# EAGLE design breadboard power supply smd (EAGLE 6.1)
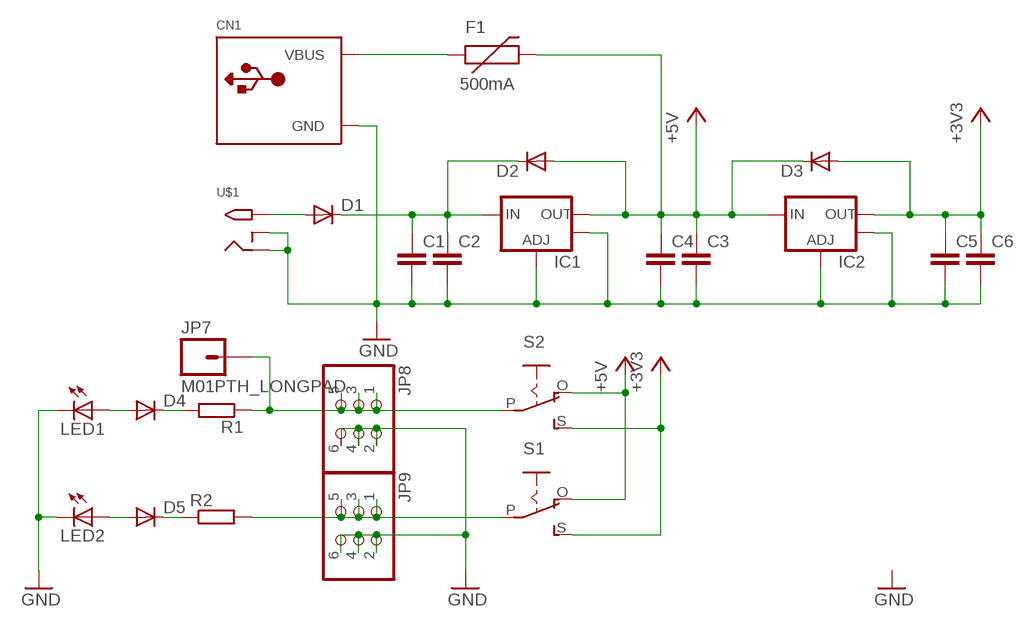
[diagram p0: schematic, sheet 1]

## Parts
C1  C-EUC0805K  [C0805K]
C2  C-EUC0805K  [C0805K]
C3  C-EUC0805K  [C0805K]
C4  C-EUC0805K  [C0805K]
C5  C-EUC0805K  [C0805K]
C6  C-EUC0805K  [C0805K]
CN1  USBPWR-ONLY  [USB-MINIB-THM]
D1  DIODE-MINIMELF  [MINIMELF]
D2  DIODE-MINIMELF  [MINIMELF]
D3  DIODE-MINIMELF  [MINIMELF]
D4  DIODE-MINIMELF  [MINIMELF]
D5  DIODE-MINIMELF  [MINIMELF]
F1  500mA  PTC0603  [0603]
IC1  V_REG_LM1117SOT223  [SOT223]
IC2  V_REG_LM1117SOT223  [SOT223]
JP7  M01PTH_LONGPAD  [1X01_LONGPAD]
JP8  PINHD-2X3  [2X03]
JP9  PINHD-2X3  [2X03]
LED1  LEDCHIP-LED0805  [CHIP-LED0805]
LED2  LEDCHIP-LED0805  [CHIP-LED0805]
R1  R-EU_R0805  [R0805]
R2  R-EU_R0805  [R0805]
S1  EG1218S  [EG1218]
S2  EG1218S  [EG1218]
U$1  2.1MMJACKTHM  [PJ-102A]

## Nets
+3V3: C5.1 C6.1 D3.A IC2.2(OUT) S1.S S2.S
+5V: C3.1 C4.1 D2.A D3.C F1.2 IC1.2(OUT) IC2.3(IN) S1.O S2.O
GND: C1.2 C2.2 C3.2 C4.2 C5.2 C6.2 CN1.GND CN1.GND1(GND) CN1.GND2(GND) CN1.GND3(GND) CN1.GND4(GND) IC1.1(ADJ) IC1.4(OUT) IC2.1(ADJ) IC2.4(OUT) JP8.2 JP8.4 JP8.6 JP9.2 JP9.4 JP9.6 LED1.C LED2.C U$1.RING U$1.RING_SW
N$1: D1.A U$1.TIP
N$2: D5.C R2.1
N$3: C1.1 C2.1 D1.C D2.C IC1.3(IN)
N$4: JP7.1 JP8.1 JP8.3 JP8.5 R1.1 S2.P
N$5: D4.C R1.2
N$6: JP9.1 JP9.3 JP9.5 R2.2 S1.P
N$7: D4.A LED1.A
N$8: D5.A LED2.A
N$9: CN1.VBUS F1.1

## Library data of the parts
C1-C6 = rcl:C-EU: CAPACITOR, European symbol
CN1 = _MY_OWN_LIB:USB: USB Connectors USBMINIB - Surface Mount Female Mini-B USB Connector 4UConnector: 06564 By microbuilder.eu Thru-hole RA Female Mini-B USB Connector 4UConnector: 18732 By ladyada.net
D1-D5 = diode:DIODE-: DIODE
F1 = SparkFun-PowerIC:PTC: Resettable Fuse PTC Resettable Fuse. Spark Fun Electronics SKU : COM-08357
IC1 IC2 = SparkFun-PowerIC:V_REG_LM1117: Voltage Regulator LM1117 Standard adjustable voltage regulator but in SMD form. Spark Fun Electronics SKU : COM-00595
JP7 = _MY_OWN_LIB:M01: Header 1 Standard 1-pin 0.1" header. Use with straight break away headers (SKU : PRT-00116), right angle break away headers (PRT-00553), swiss pins (PRT-00743), machine pins (PRT-00117), and female headers (PRT-00115).
JP8 JP9 = pinhead:PINHD-2X3: PIN HEADER
LED1 LED2 = led:LED: LED OSRAM: - CHIPLED LG R971, LG N971, LY N971, LG Q971, LY Q971, LO R971, LY R971 LH N974, LH R974 LS Q976, LO Q976, LY Q976 LO Q996 - Hyper CHIPLED LW Q18S LB Q993, LB Q99A, LB R99A - SideLED LS A670, LO A670, LY A670, LG A670, LP A670 LB A673, LV A673, LT A673, LW A673 LH A674 LY A675 LS A676, LA A676, LO A676, LY A676, LW A676 LS A679, LY A679, LG A679 - Hyper Micro SIDELED® LS Y876, LA Y876, LO Y876, LY Y876 LT Y87S - SmartLED LW L88C, LW L88S LB L89C, LB L89S, LG L890 LS L89K, LO L89K, LY L89K LS L896, LA L896, LO L896, LY L896 - TOPLED LS T670, LO T670, LY T670, LG T670, LP T670 LSG T670, LSP T670, LSY T670, LOP T670, LYG T670 LG T671, LOG T671, LSG T671 LB T673, LV T673, LT T673, LW T673 LH T674 LS T676, LA T676, LO T676, LY T676, LB T676, LH T676, LSB T676, LW T676 LB T67C, LV T67C, LT T67C, LS T67K, LO T67K, LY T67K, LW E67C LS E67B, LA E67B, LO E67B, LY E67B, LB E67C, LV E67C, LT E67C LW T67C LS T679, LY T679, LG T679 LS T770, LO T770, LY T770, LG T770, LP T770 LB T773, LV T773, LT T773, LW T773 LH T774 LS E675, LA E675, LY E675, LS T675 LS T776, LA T776, LO T776, LY T776, LB T776 LHGB T686 LT T68C, LB T68C - Hyper Mini TOPLED® LB M676 - Mini TOPLED Santana® LG M470 LS M47K, LO M47K, LY M47K Source: http://www.osram.convergy.de LUXEON: - LUMILED® LXK2-PW12-R00, LXK2-PW12-S00, LXK2-PW14-U00, LXK2-PW14-V00 LXK2-PM12-R00, LXK2-PM12-S00, LXK2-PM14-U00 LXK2-PE12-Q00, LXK2-PE12-R00, LXK2-PE12-S00, LXK2-PE14-T00, LXK2-PE14-U00 LXK2-PB12-K00, LXK2-PB12-L00, LXK2-PB12-M00, LXK2-PB14-N00, LXK2-PB14-P00, LXK2-PB14-Q00 LXK2-PR12-L00, LXK2-PR12-M00, LXK2-PR14-Q00, LXK2-PR14-R00 LXK2-PD12-Q00, LXK2-PD12-R00, LXK2-PD12-S00 LXK2-PH12-R00, LXK2-PH12-S00 LXK2-PL12-P00, LXK2-PL12-Q00, LXK2-PL12-R00 Source: www.luxeon.com KINGBRIGHT: KA-3528ASYC Source: www.kingbright.com
R1 R2 = rcl:R-EU_: RESISTOR, European symbol
S1 S2 = _MY_OWN_LIB:EG1218: SLIDING SWITCH 0.1" spacing through hole, vertical SPDT slide switch http://www.ladyada.net/library/pcb/eaglelibrary.html
U$1 = adafruit:2.1MMJACK: 2.1mm x 5.5mm THM DC jack with internal switch. Digikey part #PJ-102A, 4UCON part #05537 2.1mm x 5.5mm SMT DC jack with internal switch. Digikey part #PJ-002A-SMT, 4UCON part #03267 By microbuilder.eu & adafruit.com

## Board
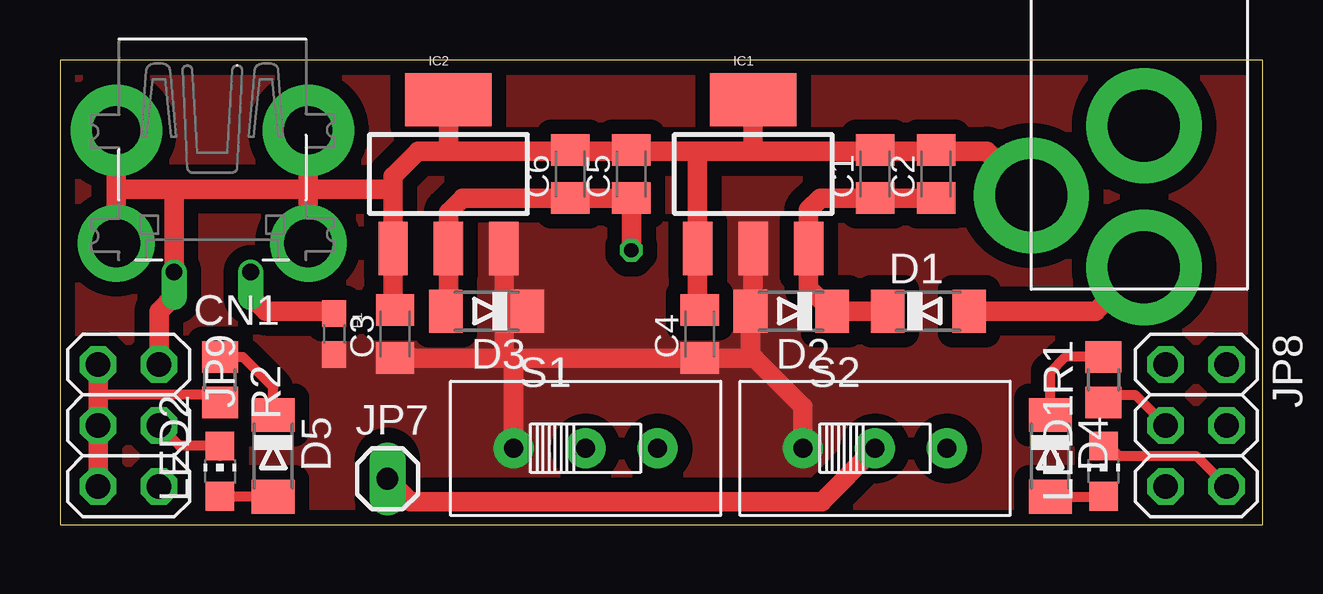
[diagram p1: board, top side]
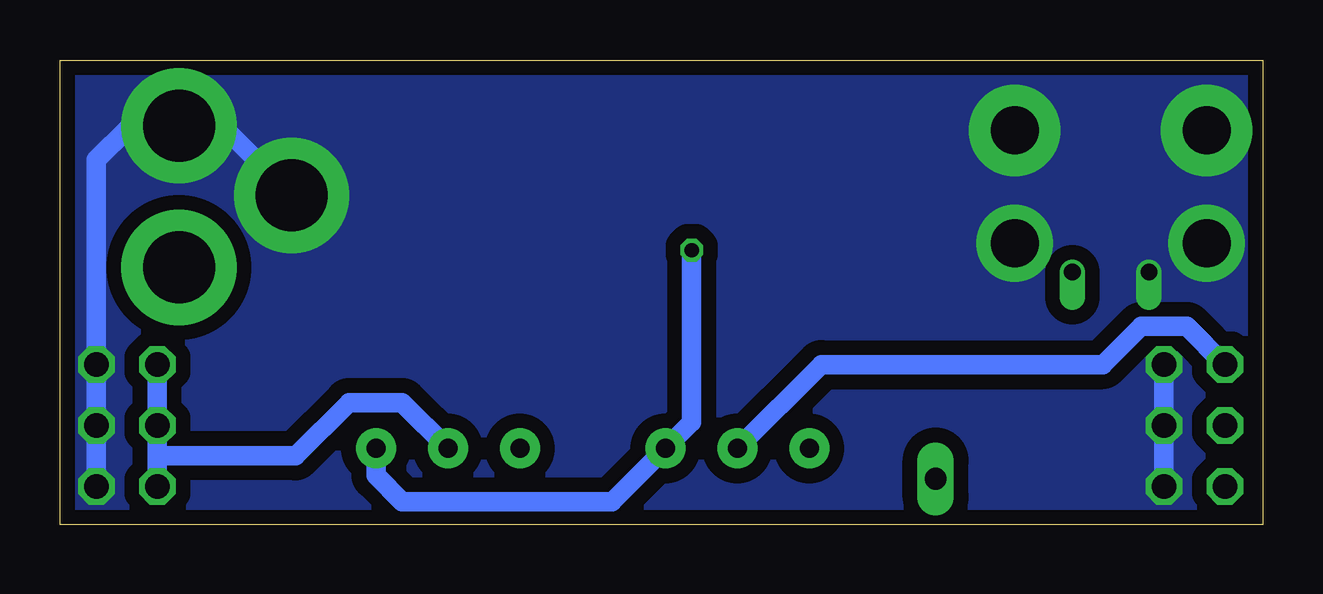
[diagram p2: board, bottom side, seen from below]

Size 50.15 x 19.36 mm. Coordinates in mm from the lower left corner, seen from the top.
Outline: 0,0 50.15,0 50.15,19.36 0,19.36 0,0
Copper layers (1*16): Top 0.0356mm / dielectric 1.5011mm / Bottom 0.0356mm
Design rules: minimum track width 6mil, minimum drill 13mil, track to track 6mil, track to pad 6mil, pad to pad 6mil, via to via 6mil, smd to smd 6mil, copper to edge 15mil, drill to drill 6mil, minimum pad ring 7mil, minimum via ring 7mil, stop-mask expansion 3mil, vias tented up to drill 0mil, thermal gap 10mil

### Footprints (pad centres in the part's own frame; a part is rotated, then mirrored left to right if it is on the bottom)
C0805K = smd 1.3 x 1.6: 1 -1,0; 2 1,0
USB-MINIB-THM = drill 0.7 offset: GND 1.6,9.8; VBUS -1.6,9.8 | drill 2 pad 3.81: GND1 -4,3.9; GND4 4,3.9 | drill 2 pad 3.2: GND2 -4,8.6; GND3 4,8.6
MINIMELF = smd 1.4 x 1.8: A 1.7,0; C -1.7,0
0603 = smd 1.1 x 1: 1 -0.85,0; 2 0.85,0
SOT223 = smd 1.219 x 2.235: 1 -2.311,-3.099; 2 0,-3.099; 3 2.311,-3.099 | smd 3.6 x 2.2: 4 0,3.099
1X01_LONGPAD = drill 0.9 pad 1.524 long: 1 0,0
2X03 = drill 1.016 octagon: 1 -2.54,-1.27; 2 -2.54,1.27; 3 0,-1.27; 4 0,1.27; 5 2.54,-1.27; 6 2.54,1.27
CHIP-LED0805 = smd 1.2 x 1.2: A 0,-1.05; C 0,1.05
R0805 = smd 1.3 x 1.5: 1 -0.95,0; 2 0.95,0
EG1218 = drill 0.8 pad 1.676: O -3,0; P 0,0; S 3,0
PJ-102A = drill 3 pad 4.8: RING 0.1,-3.39; RING_SW -4.6,-6.29; TIP 0.1,-9.29

### Placement (x,y rotation side)
C1  33.97,14.61 90 top
C2  36.51,14.61 90 top
C3  13.97,7.94 90 top
C4  26.67,7.94 90 top
C5  23.81,14.61 90 top
C6  21.27,14.61 90 top
CN1  6.35,20.32 180 top
D1  36.2,8.89 0 top
D2  30.48,8.89 180 top
D3  17.78,8.89 180 top
D4  41.27,2.86 270 top
D5  8.89,2.86 270 top
F1  11.43,7.94 270 top
IC1  28.89,14.61 0 top
IC2  16.19,14.61 0 top
JP7  13.65,1.91 0 top
JP8  47.36,4.13 270 top
JP9  2.86,4.13 270 top
LED1  43.5,2.22 0 top
LED2  6.67,2.22 0 top
R1  43.5,6.03 90 top
R2  6.67,6.03 270 top
S1  21.91,3.17 0 top
S2  33.97,3.17 0 top
U$1  45.09,20 0 top

### Tracks (layer width: path | path; a pad name or v marks a point on that pad's centre or on a via)
+3V3  (via drill 0.6)
  Top 0.813: D3.A 16.19,9 IC2.2 16.19,13.02 16.78,13.61 C6.1 C5.1 v23.81,11.43
  Bottom 0.813: v23.81,11.43 23.81,4.27 S1.S 27.13,0.95 35.88,0.95 36.97,2.05 S2.S
+5V
  Top 0.813: IC1.2 28.89,9 D2.A 28.78,7.19 | IC2.3 18.5,8.89 | 18.5,8.89 18.5,7.07 18.41,6.99 18.41,6.94 | C3.1 18.41,6.94 | 18.41,6.94 19.05,6.94 | 19.05,6.94 24.72,6.94 | 24.5,6.94 C4.1 28.94,6.94 30.97,4.91 S2.O | D3.C 18.5,8.89 | S1.O 18.91,6.79 19.05,6.94
  pour Top (isolate 0.61, no thermals): 0.32,0.32 49.85,0.32 49.85,19.05 0.32,19.05
GND
  Top 0.406: 6.67,2.86 LED2.C 4.98,3.27 JP9.4 | LED1.C 43.72,3.27 44.13,2.86 47.36,2.86 JP8.6
  Top 0.813: 16.9,17.7 IC2.4 16.19,15.56 | 16.19,15.56 14.92,15.56 13.88,14.52 13.88,13.97 | 16.19,15.56 21.27,15.56 | 21.27,15.56 23.81,15.56 | 23.81,15.56 26.67,15.56 | 26.67,15.56 28.89,15.56 | 28.89,15.56 34.29,15.56 | 34.29,15.56 36.51,15.56 | 36.51,15.56 38.64,15.56 U$1.RING_SW | IC1.4 28.89,15.56 | 13.88,13.97 IC2.1 13.88,9.34 C3.2 | C6.2 21.27,15.56 | C5.2 23.81,15.56 | 26.67,15.56 26.58,15.47 IC1.1 26.58,9.34 C4.2 | C1.2 34.24,15.61 34.29,15.56 | C2.2 36.51,15.56 | 10.48,13.97 13.88,13.97 | CN1.GND3 2.35,13.97 | 2.35,13.97 CN1.GND4 | CN1.GND1 CN1.GND2 10.35,13.84 10.48,13.97 | 10.48,13.97 4.76,13.97 | 4.76,13.97 2.35,13.97 | 4.76,13.97 4.75,13.96 CN1.GND 4.76,10.51 4.76,9.53 4.13,8.89 JP9.2
  Bottom 0.813: 45.08,16.51 47.31,16.51 48.63,15.19 JP8.2 JP8.4 JP8.6 | U$1.RING_SW 43.28,16.51 45.08,16.51 | 45.08,16.51 U$1.RING | JP9.2 JP9.4 JP9.6
  pour Bottom (isolate 0.61, no thermals): -0.32,-0.32 50.48,-0.32 50.48,19.68 -0.32,19.68
N$1
  Top 0.813: U$1.TIP 45,10.71 43.18,8.89 D1.A
N$2
  Top 0.406: D5.C 8.89,5.71 7.62,6.98 R2.1
N$3
  Top 0.813: C2.1 C1.1 31.7,13.61 31.2,13.11 IC1.3 31.2,9.87 D2.C D1.C
N$4
  Top 0.406: R1.1 43.82,5.08 44.13,5.4 44.82,5.4 JP8.3
  Top 0.813: JP7.1 14.61,0.95 31.75,0.95 S2.P
  Bottom 0.813: S2.P 35.88,5.08 38.1,5.08 40.32,2.86 46.09,2.86 | JP8.5 46.09,2.86 | 46.09,2.86 JP8.3 JP8.1
N$5
  Top 0.406: 43.38,7.1 R1.2 41.91,6.98 41.27,6.35 D4.C
N$6
  Top 0.406: R2.2 6.35,5.4 1.59,5.4
  Top 0.813: JP9.5 JP9.3 1.59,5.4 JP9.1
  Bottom 0.813: S1.P 18.41,6.67 6.67,6.67 5.08,8.26 3.17,8.26 JP9.1
N$7
  Top 0.406: D4.A 43.48,1.16 LED1.A
N$8
  Top 0.406: D5.A 6.68,1.16 LED2.A
N$9
  Top 0.813: CN1.VBUS 7.95,9.51 8.57,8.89 11.43,8.89 F1.1